# Altium schematic sheet Header.SchDoc
size A4 portrait; DocumentNumber: 1; SheetNumber: 1; SheetTotal: 5
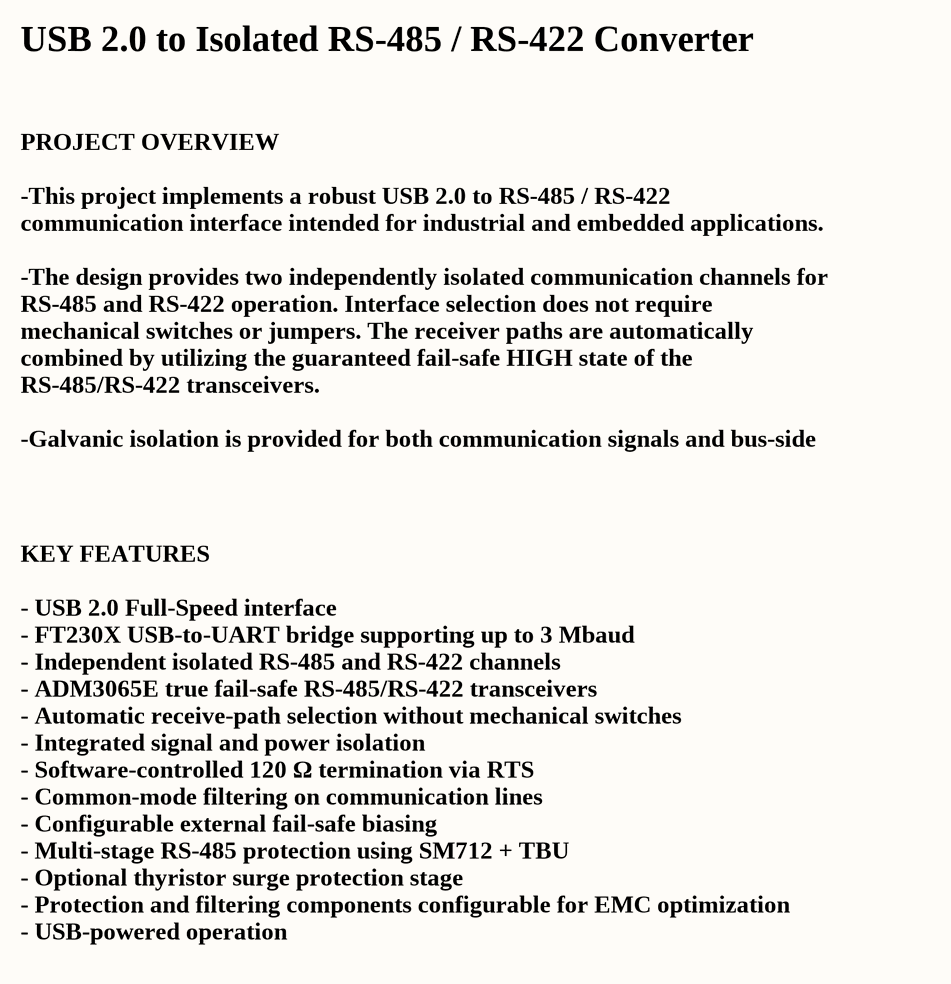
[diagram p0: Header.SchDoc]

## Notes on the sheet
- USB 2.0 to Isolated RS-485 / RS-422 Converter
- PROJECT OVERVIEW
  -This project implements a robust USB 2.0 to RS-485 / RS-422 communication interface intended for industrial and embedded applications.
  -The design provides two independently isolated communication channels for RS-485 and RS-422 operation. Interface selection does not require mechanical switches or jumpers. The receiver paths are automatically combined by utilizing the guaranteed fail-safe HIGH state of the RS-485/RS-422 transceivers.
  -Galvanic isolation is provided for both communication signals and bus-side power. The RS-485 interface includes software-controlled 120 Ω termination and a configurable multi-stage protection network designed to improve immunity against ESD, surge and other bus transients.
- KEY FEATURES
  - USB 2.0 Full-Speed interface
  - FT230X USB-to-UART bridge supporting up to 3 Mbaud
  - Independent isolated RS-485 and RS-422 channels
  - ADM3065E true fail-safe RS-485/RS-422 transceivers
  - Automatic receive-path selection without mechanical switches
  - Integrated signal and power isolation
  - Software-controlled 120 Ω termination via RTS
  - Common-mode filtering on communication lines
  - Configurable external fail-safe biasing
  - Multi-stage RS-485 protection using SM712 + TBU
  - Optional thyristor surge protection stage
  - Protection and filtering components configurable for EMC optimization
  - USB-powered operation
- Tarih/Date
- Tasa/Desig
- Kont/Check
- Onay/Appr
- Sayfa/Sht
- Form
- Ortam/Env
- A4
- /
- Deg Tarihi/Chng Date
- Deg Onay/Chng Appr
- Rev
- (c) 2022 by SCSG Elektronik A.Ş.
  All rights Reserved. No part of this document may be produced or transmitted in any form or by any means electronic, mechanical, photocopying, recording, or otherwise, without prior written permission of SCSG.